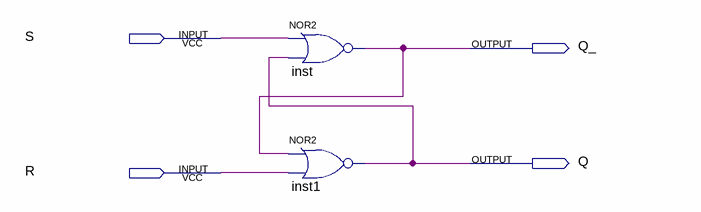
[diagram p0: schematic sheet]
// Quartus schematic SRLatch.bdf as structural Verilog: 2 symbols, 4 pins
module SRLatch (
  input  S,
  input  R,
  output Q_,
  output Q
);

  nor inst (Q_, S, Q);
  nor inst1 (Q, Q_, R);
endmodule
